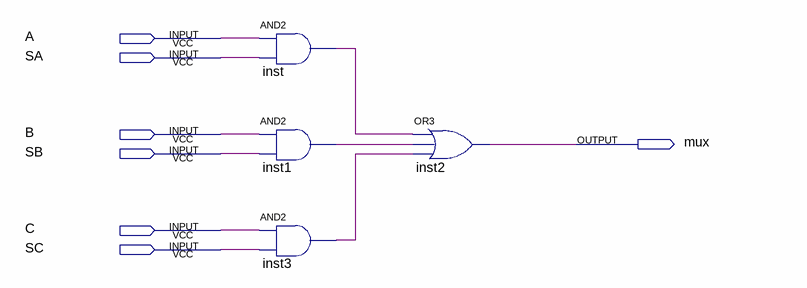
[diagram p0: schematic sheet]
// Quartus schematic mux3.bdf as structural Verilog: 4 symbols, 7 pins
module mux3 (
  input  A,
  input  SA,
  input  B,
  input  SB,
  input  C,
  input  SC,
  output mux
);

  wire inst1_out, inst3_out, inst_out;

  and inst (inst_out, A, SA);
  and inst1 (inst1_out, B, SB);
  and inst3 (inst3_out, C, SC);
  or inst2 (mux, inst_out, inst1_out, inst3_out);
endmodule
